# Altium project PHANTOM_VCU.PrjPcb (part 1 of 3)
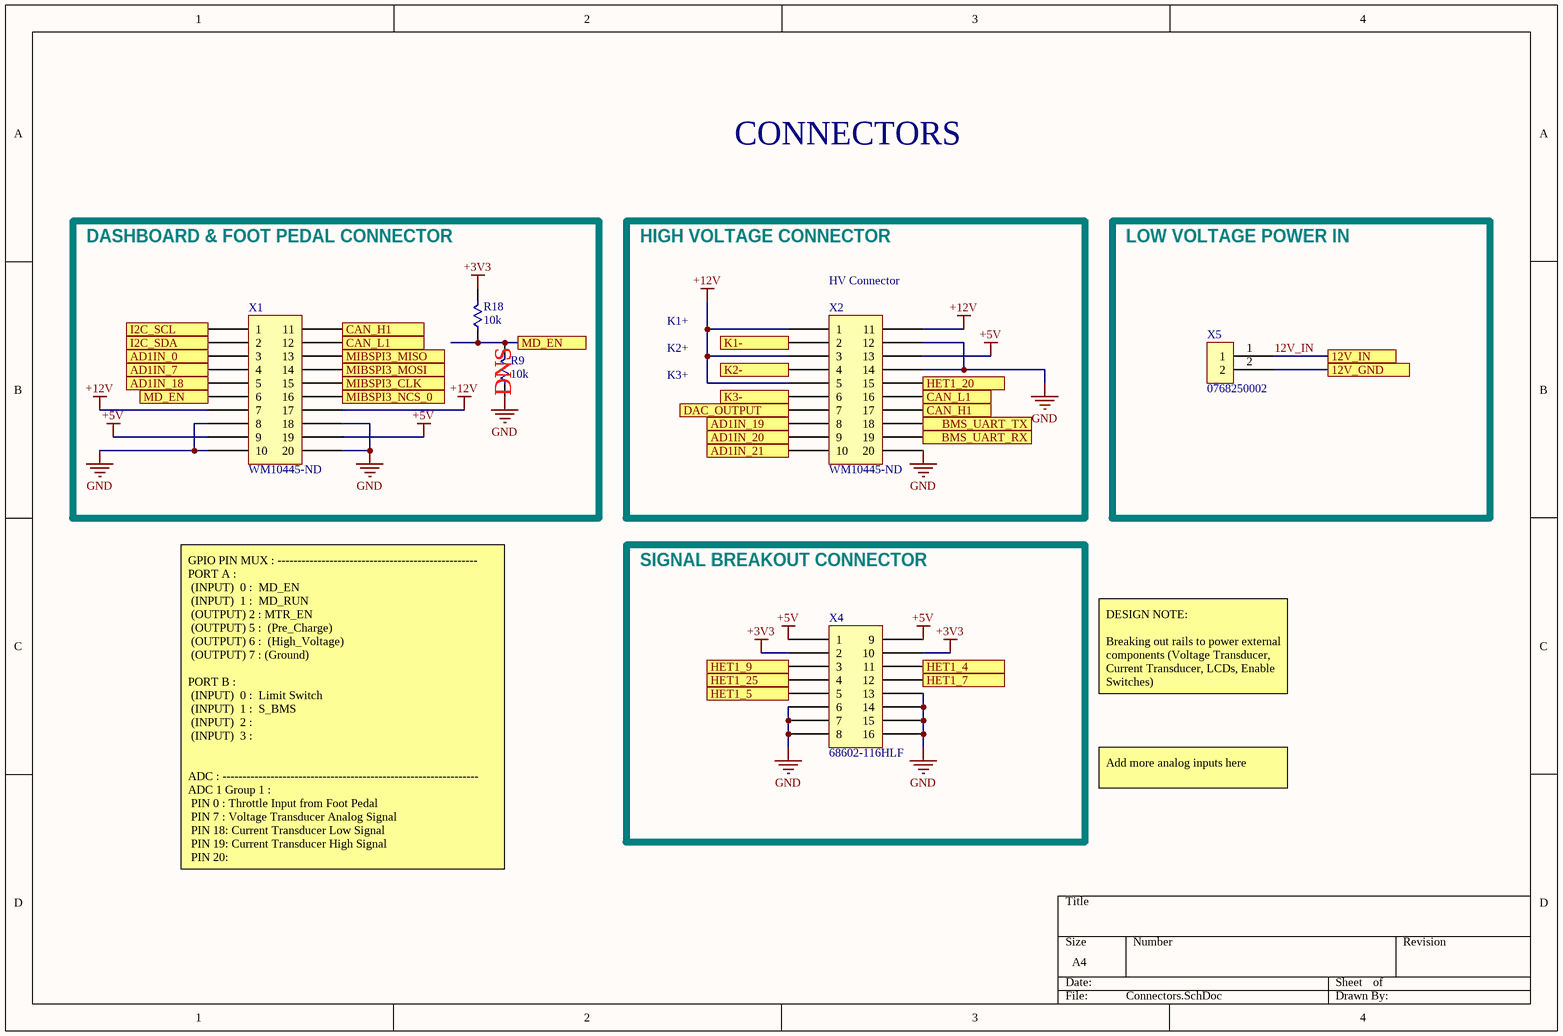
[diagram p0: Connectors.SchDoc]
10 sheets, 183 parts. Net scope: flat (ports and power ports of the same name join across sheets).
Board file: VCU_LAYOUT.PcbDoc
Sheets:
  Connectors.SchDoc
  Power_Sensing.SchDoc
  BUCK_CONVERTERS.SchDoc
  Power_MCU.SchDoc
  VCU_Schematic.SchDoc
  MCU_Signals.SchDoc
  CAN.SchDoc
  Contactor_Switching.SchDoc
  ADC_Decoupling.SchDoc
  DAC.SchDoc

## Sheet Connectors.SchDoc
size A4; DocumentNumber: 1; SheetNumber: 1; SheetTotal: 8

### Parts
R9  10k  [R0402]
R18  10k  [R0402]
X1  WM10445-ND  [MOLEX_20pin]
X2  WM10445-ND  [MOLEX_20pin]
X4  68602-116HLF  [16PIN_HEADER]
X5  0768250002  [MOLEX_2PIN_MEGAFIT]

### Blocks framed on the sheet
DNS: R9 R18 X1
HIGH VOLTAGE CONNECTOR: X2
LOW VOLTAGE POWER IN: X5
SIGNAL BREAKOUT CONNECTOR: X4

### Ports
12V_GND, 12V_IN, AD1IN_0, AD1IN_7, AD1IN_18, AD1IN_19, AD1IN_20, AD1IN_21, BMS_UART_RX, BMS_UART_TX, CAN_H1, CAN_L1, DAC_OUTPUT, HET1_4, HET1_5, HET1_7, HET1_9, HET1_20, HET1_25, I2C_SCL, I2C_SDA, K1-, K2-, K3-, MD_EN, MIBSPI3_CLK, MIBSPI3_MISO, MIBSPI3_MOSI, MIBSPI3_NCS_0

### Nets
+3V3: R18.2 X4.2 X4.10
+5V: X1.9 X1.19 X2.13 X4.1 X4.9
+12V: X1.7 X1.17 X2.1 X2.3 X2.5 X2.11
GND: R9.1 X1.8 X1.10 X1.18 X1.20 X2.12 X2.14 X2.20 X4.6 X4.7 X4.8 X4.13 X4.14 X4.15 X4.16
12V_GND: X5.2 ; port 12V_GND
12V_IN: X5.1 ; port 12V_IN
AD1IN_0: X1.3 ; port AD1IN_0
AD1IN_7: X1.4 ; port AD1IN_7
AD1IN_18: X1.5 ; port AD1IN_18
AD1IN_19: X2.8 ; port AD1IN_19
AD1IN_20: X2.9 ; port AD1IN_20
AD1IN_21: X2.10 ; port AD1IN_21
BMS_UART_RX: X2.19 ; port BMS_UART_RX
BMS_UART_TX: X2.18 ; port BMS_UART_TX
CAN_H1: X1.11 X2.17 ; port CAN_H1
CAN_L1: X1.12 X2.16 ; port CAN_L1
DAC_OUTPUT: X2.7 ; port DAC_OUTPUT
HET1_4: X4.11 ; port HET1_4
HET1_5: X4.5 ; port HET1_5
HET1_7: X4.12 ; port HET1_7
HET1_9: X4.3 ; port HET1_9
HET1_20: X2.15 ; port HET1_20
HET1_25: X4.4 ; port HET1_25
I2C_SCL: X1.1 ; port I2C_SCL
I2C_SDA: X1.2 ; port I2C_SDA
K1-: X2.2 ; port K1-
K2-: X2.4 ; port K2-
K3-: X2.6 ; port K3-
MD_EN: R9.2 R18.1 X1.6 ; port MD_EN
MIBSPI3_CLK: X1.15 ; port MIBSPI3_CLK
MIBSPI3_MISO: X1.13 ; port MIBSPI3_MISO
MIBSPI3_MOSI: X1.14 ; port MIBSPI3_MOSI
MIBSPI3_NCS_0: X1.16 ; port MIBSPI3_NCS_0

### Notes on the sheet
- CONNECTORS
- DASHBOARD & FOOT PEDAL CONNECTOR
- (near X2) HV Connector
- K1+
- K2+
- K3+
- DESIGN NOTE:
  Breaking out rails to power external components (Voltage Transducer, Current Transducer, LCDs, Enable Switches)
- Add more analog inputs here
- GPIO PIN MUX : --------------------------------------------------
  PORT A :
  (INPUT)		0 : 	MD_EN
  (INPUT)		1 : 	MD_RUN
  (OUTPUT)	2 :	MTR_EN
  (OUTPUT)	5 : 	(Pre_Charge)
  (OUTPUT)	6 : 	(High_Voltage)
  (OUTPUT)	7 :	(Ground)
  PORT B :
  (INPUT)		0 : 	Limit Switch
  (INPUT)		1 : 	S_BMS
  (INPUT)		2 :
  (INPUT)		3 :
  ADC : ----------------------------------------------------------------
  ADC 1 Group 1 :
  PIN 0 : Throttle Input from Foot Pedal
  PIN 7 : Voltage Transducer Analog Signal
  PIN 18: Current Transducer Low Signal
  PIN 19: Current Transducer High Signal
  PIN 20:

### Library data of the parts
R9 R18 = RC0402JR-0710KL: RES SMD 10K OHM 5% 1/16W 0402; Manufacturer: Yageo; Resistance: 10kR; Power Rating: 62.5mW; Voltage Rating: 50V; Temperature Coefficient: 100ppm/°C; Max Power Dissipation: 63mW; Supplier 1: Digi-Key; Manufacturer Part Number: RC0402JR-0710KL; Stock 1: 47303622; Pricing 1: 1=0.1, 10=0.018, 100=0.0073, 1000=0.0033, 2500=0.0029, 5000=0.0024 (USD); Case/Package: 0402; Case Code (Metric): 1005; Case Code (Imperial): 0402; Min Operating Temperature: -55°C; Max Operating Temperature: 155°C; Packaging: Tape and Reel; Tolerance: 5%; Package Quantity: 1; Composition: Thick Film; Number of Terminations: 2; Termination: SMD/SMT; Military Standard: Not; Features: Moisture Resistant; Length: 1mm; Height: 0.016inch; Width: 0.02inch; Depth: 0.5mm; REACH SVHC: Unknown; Lead Free: Lead Free; Supplier Part Number 1: 311-10KJRCT-ND
X1 X2 = 0346916200: CONN_20Positions Molex Stac64 Header, Shrouded Connector 0.100" (2.54mm) Through Hole, Right Angle Tin; Number of Positions: 20; Connector Type: Male Pin; Pitch: 0.1inch; Supplier 1: Digi-Key; Manufacturer: Molex; Manufacturer Part Number: 0346916200; Stock 1: 334; Pricing 1: 1=3.07, 10=2.946, 100=2.4546, 500=2.0864, 1000=1.7796, 5000=1.5955 (USD); Case/Package: 100; Colour: Black; Contact Plating: Tin; Package Quantity: 560; Packaging: Tray; Number of Rows: 2; Termination: Solder; Row Spacing: 0.1inch; ComponentLink1URL: https://datasheet.ciiva.com/29142/987651-0141-29142848.pdf; ComponentLink1Description: https://datasheet.ciiva.com/29142/987651-0141-29142848.pdf; Supplier Part Number 1: WM10445-ND
X4 = 68602-116HLF: CONN_HeaderPins16pos1  6 Positions Header, Unshrouded Connector 0.100" (2.54mm) Through Hole Gold or Gold, GXT™; Manufacturer: Amphenol FCI; Current Rating: 3A; Voltage Rating: 1.5kV; Number of Positions: 16; Gender: Male; Connector Type: Male Pin; Insulation Resistance: 5GR; Row Spacing: 0.1inch; Mating Post Length: 5.84mm; Supplier 1: Digi-Key; Manufacturer Part Number: 68602-116HLF; Stock 1: 1898; Pricing 1: 1=0.79, 10=0.698, 100=0.6019, 500=0.4925, 1000=0.4378, 5000=0.383, 10000=0.3639 (USD); Mount: Through Hole; Contact Plating: Nickel,Gold,GXT; Contact Material: Bronze; Colour: Black; Housing Colour: Black; Housing Material: Thermoplastic; Min Operating Temperature: -65°C; Max Operating Temperature: 125°C; Number of Rows: 2; Packaging: Bulk; Package Quantity: 100; Termination: Solder; Max Voltage Rating (AC): 1.5kV; Number of Contacts: 16; Orientation: Straight; Contact Gender: Male; Length: 20.32mm; Pitch: 2.54mm; Depth: 4.83mm; Contact Mating Length: 0.23inch; Termination Post Length: 3.81mm; Radiation Hardening: No; REACH SVHC: No SVHC; Flammability Rating: UL94 V-0; ComponentLink1URL: https://datasheet.ciiva.com/16726/67996-16726040.pdf; ComponentLink1Description: https://datasheet.ciiva.com/16726/67996-16726040.pdf; ComponentLink2URL: https://datasheet.ciiva.com/9465/67996-9465931.pdf; ComponentLink2Description: https://datasheet.ciiva.com/9465/67996-9465931.pdf; ComponentLink3URL: https://datasheet.ciiva.com/728/67996-728940.pdf; ComponentLink3Description: https://datasheet.ciiva.com/728/67996-728940.pdf; ComponentLink4URL: https://datasheet.ciiva.com/5157/67996-225486-5157197.pdf; ComponentLink4Description: https://datasheet.ciiva.com/5157/67996-225486-5157197.pdf; Supplier Part Number 1: 609-3364-ND
X5 = 0768250002: CONN_2Position_MEGAFIT Molex Through Hole, Right Angle Tin; Number of Positions: 2; Connector Type: Male Pin; Row Spacing: 0.224inch; Supplier 1: Digi-Key; Manufacturer: Molex; Manufacturer Part Number: 0768250002; Stock 1: 2862; Pricing 1: 1=1.08, 10=0.946, 25=0.89, 50=0.853, 100=0.816, 250=0.7418, 500=0.6676, 1000=0.5934, 2500=0.5378 (USD); Mount: Through Hole; Colour: Black; Contact Plating: Tin; Packaging: Tray; Number of Rows: 2; Termination: Solder; Fastening Type: Ramp; ComponentLink1URL: http://www.molex.com/pdm_docs/ps/PS-76823-100.pdf; ComponentLink1Description: http://www.molex.com/pdm_docs/ps/PS-76823-100.pdf; Supplier Part Number 1: WM11969-ND

## Sheet Power_Sensing.SchDoc
size A4; DocumentNumber: 2; SheetNumber: 2; SheetTotal: 8
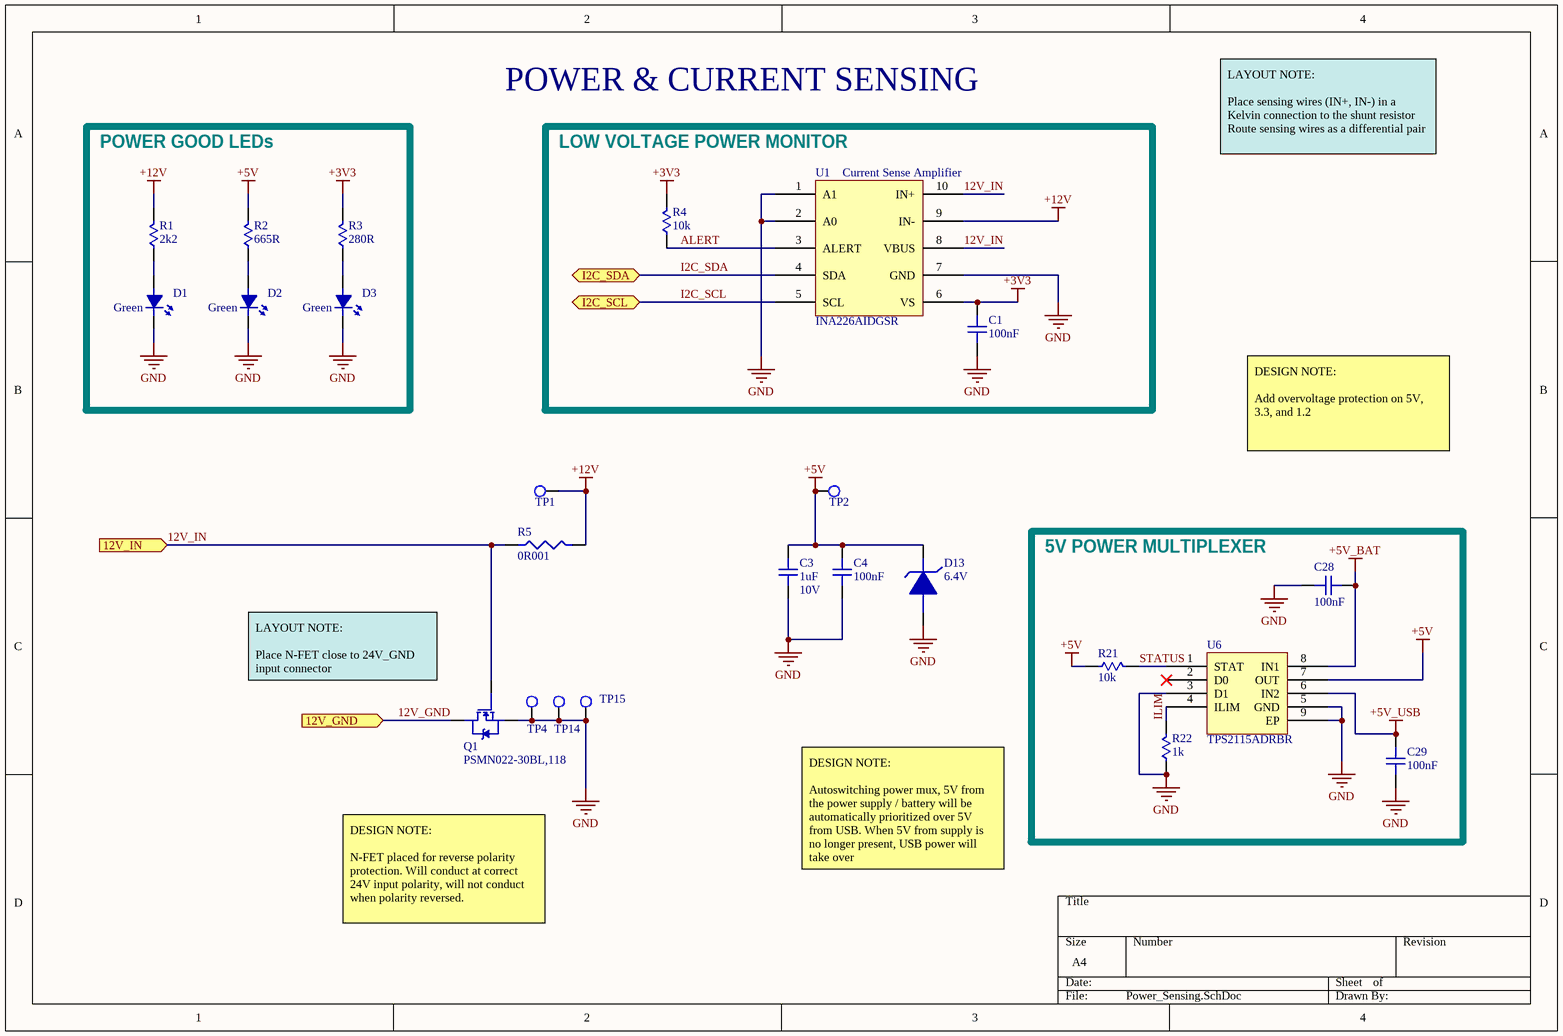
[diagram p1: Power_Sensing.SchDoc]

### Parts
C1  100nF  [C0402]
C3  1uF  Voltage Rating: 10V  [C0402]
C4  100nF  [C0402]
C28  100nF  [C0402]
C29  100nF  [C0402]
D1  Green  [LED_0603]
D2  Green  [LED_0603]
D3  Green  [LED_0603]
D13  6.4V  [DIODE_TVS]
Q1  PSMN022-30BL,118  [D2PAK_FETs]
R1  2k2  [R0402]
R2  665R  [R0402]
R3  280R  [R0402]
R4  10k  [R0402]
R5  0R001  [R2512]
R21  10k  [R0402]
R22  1k  [R0402]
TP1  5015  [TP_HOOK]  (value not drawn)
TP2  5015  [TP_HOOK]  (value not drawn)
TP4  5015  [TP_HOOK]  (value not drawn)
TP14  5015  [TP_HOOK]  (value not drawn)
TP15  5015  [TP_HOOK]  (value not drawn)
U1  INA226AIDGSR  [10-VSSOP_INA226]
U6  TPS2115ADRBR  [VSON-8]

### Blocks framed on the sheet
POWER GOOD LEDs: D1-D3 R1-R3
LOW VOLTAGE POWER MONITOR: C1 R4 U1
5V POWER MULTIPLEXER: C28 C29 R21 R22 U6

### Ports
12V_GND, 12V_IN, I2C_SCL, I2C_SDA

### Nets
+3V3: C1.2 R3.2 R4.2 U1.6(VS)
+5V: C3.2 C4.2 D13.1 R2.2 R21.1 TP2.1 U6.7(OUT)
+5V_BAT: C28.1 U6.8(IN1)
+5V_USB: C29.2 U6.6(IN2)
+12V: R1.2 R5.2 TP1.1 U1.9(IN-)
GND: C1.1 C3.1 C4.1 C28.2 C29.1 D1.2 D2.2 D3.2 D13.2 Q1.3 R22.1 TP4.1 TP14.1 TP15.1 U1.1(A1) U1.2(A0) U1.7(GND) U6.3(D1) U6.5(GND) U6.9(EP)
12V_GND: Q1.4 ; port 12V_GND
12V_IN: Q1.1 R5.1 U1.8(VBUS) U1.10(IN+) ; port 12V_IN
ALERT: R4.1 U1.3(ALERT)
I2C_SCL: U1.5(SCL) ; port I2C_SCL
I2C_SDA: U1.4(SDA) ; port I2C_SDA
ILIM: R22.2 U6.4(ILIM)
STATUS: R21.2 U6.1(STAT)
NetD1_1: D1.1 R1.1
NetD2_1: D2.1 R2.1
NetD3_1: D3.1 R3.1

Not connected (* = marked no-connect by the designer): U6 2(D0)*

### Notes on the sheet
- POWER & CURRENT SENSING
- (near U1) Current Sense Amplifier
- LAYOUT NOTE:
  Place sensing wires (IN+, IN-) in a Kelvin connection to the shunt resistor
  Route sensing wires as a differential pair
- DESIGN NOTE:
  Add overvoltage protection on 5V, 3.3, and 1.2
- (near Q1) LAYOUT NOTE:
  Place N-FET close to 24V_GND input connector
- DESIGN NOTE:
  N-FET placed for reverse polarity protection. Will conduct at correct 24V input polarity, will not conduct when polarity reversed.
- DESIGN NOTE:
  Autoswitching power mux, 5V from the power supply / battery will be automatically prioritized over 5V from USB. When 5V from supply is no longer present, USB power will take over

### Library data of the parts
C1 C4 C28 C29 = CL05A104MP5NNNC: CAP MLCC 0.1uF 10V X5R 0402 20% SMD 0402 85C Paper T/R; Manufacturer: Samsung; Supplier 1: Digi-Key; Manufacturer Part Number: CL05A104MP5NNNC; Stock 1: 100000; Pricing 1: 1=0.1, 10=0.024, 100=0.0106, 500=0.0076, 1000=0.006, 2500=0.0054, 5000=0.005 (USD); Mount: Surface Mount; Case/Package: 0402; Case Code (Metric): 1005; Case Code (Imperial): 0402; Min Operating Temperature: -55°C; Max Operating Temperature: 85°C; Packaging: Tape and Reel; Capacitance: 100nF; Tolerance: 20%; Voltage Rating: 10V; Dielectric: X5R; Voltage Rating (DC): 10V; Length: 1mm; Height: 0.5mm; Width: 0.02inch; Thickness: 0.022inch; Depth: 0.5mm; Radiation Hardening: No; Lead Free: Lead Free; ComponentLink1URL: https://media.digikey.com/pdf/Data%20Sheets/Samsung%20PDFs/CL_Series_MLCC_ds.pdf; ComponentLink1Description: https://media.digikey.com/pdf/Data%20Sheets/Samsung%20PDFs/CL_Series_MLCC_ds.pdf; Supplier Part Number 1: 1276-1443-1-ND
C3 = CL05A105MP5NNNC: CAP MLCC 1uF 10V 0402 X5R 20% SMD 0402 85C Paper T/R; Manufacturer: Samsung; Supplier 1: Digi-Key; Manufacturer Part Number: CL05A105MP5NNNC; Stock 1: 100000; Pricing 1: 1=0.1, 10=0.031, 100=0.014, 500=0.01, 1000=0.0079, 2500=0.0072, 5000=0.0066 (USD); Mount: Surface Mount; Case/Package: 0402; Case Code (Metric): 1005; Case Code (Imperial): 0402; Min Operating Temperature: -55°C; Max Operating Temperature: 85°C; Package Quantity: 1; Packaging: Tape and Reel; Capacitance: 1uF; Tolerance: 20%; Dielectric: X5R; Voltage Rating (DC): 10V; Length: 1mm; Height: 0.5mm; Width: 0.02inch; Thickness: 0.022inch; Depth: 0.5mm; Radiation Hardening: No; Lead Free: Lead Free; ComponentLink1URL: https://media.digikey.com/pdf/Data%20Sheets/Samsung%20PDFs/CL_Series_MLCC_ds.pdf; ComponentLink1Description: https://media.digikey.com/pdf/Data%20Sheets/Samsung%20PDFs/CL_Series_MLCC_ds.pdf; Supplier Part Number 1: 1276-1448-1-ND
D1-D3 = 150060VS75000: LED GREEN CLEAR 0603 SMD  LED, 0603, B GREEN,  40MCD, 570NM; Manufacturer: Wurth Electronics; Viewing Angle: 140°; Forward Voltage: 2V; Lens Style: Clear,Rectangular; Forward Current: 30mA; Test Current: 20mA; Supplier 1: Digi-Key; Manufacturer Part Number: 150060VS75000; Stock 1: 207370; Pricing 1: 1=0.14, 50=0.129, 100=0.11, 500=0.095 (USD); Mount: Surface Mount; Case/Package: 0603; Number of Pins: 2; Color: Green; Case Code (Metric): 1608; Case Code (Imperial): 0603; Min Operating Temperature: -40°C; Max Operating Temperature: 85°C; Luminous Intensity: 40mcd; Wavelength: 570nm; Package Quantity: 1; Packaging: Tape and Reel; Dominant Wavelength: 570nm; Length: 1.6mm; Height: 0.7mm; Width: 0.8mm; REACH SVHC: Unknown; ComponentLink1URL: http://www.farnell.com/datasheets/1911347.pdf; ComponentLink1Description: http://www.farnell.com/datasheets/1911347.pdf; ComponentLink2URL: https://katalog.we-online.de/led/datasheet/150060VS75000.pdf; ComponentLink2Description: https://katalog.we-online.de/led/datasheet/150060VS75000.pdf; ComponentLink3URL: https://www.distrelec.biz/Web/Downloads/_t/ds/150060VS75000_eng_tds.pdf?mime=application%2Fpdf; ComponentLink3Description: https://www.distrelec.biz/Web/Downloads/_t/ds/150060VS75000_eng_tds.pdf?mime=application%2Fpdf; ComponentLink4URL: http://www.produktinfo.conrad.com/datenblaetter/750000-774999/759431-da-01-en-CHIPLED_0603_W_KL_H_GRUEN_150060VS7500.pdf; ComponentLink4Description: http://www.produktinfo.conrad.com/datenblaetter/750000-774999/759431-da-01-en-CHIPLED_0603_W_KL_H_GRUEN_150060VS7500.pdf; Supplier Part Number 1: 732-4980-1-ND
D13 = SMAJ5.0A: DIODE TVS_6V4 5VWM 9.2VC SMA; Manufacturer: Littelfuse; Clamping Voltage: 9.2V; Polarity: Unidirectional; Power Dissipation: 400W; Voltage Rating (DC): 5V; Number of Elements: 1; Max Surge Current: 43.5A; Power Line Protection: No; Test Current: 10mA; Max Breakdown Voltage: 7V; Max Reverse Leakage Current: 800uA; Max Power Dissipation: 3.3W; Element Configuration: Single; Supplier 1: Digi-Key; Manufacturer Part Number: SMAJ5.0A; Stock 1: 78251; Pricing 1: 1=0.51, 10=0.359, 25=0.2948, 100=0.2359, 250=0.1716, 500=0.1394, 1000=0.1072, 2500=0.0965 (USD); Mount: Surface Mount; Number of Pins: 2; Min Operating Temperature: -65°C; Max Operating Temperature: 150°C; Direction: Unidirectional; Package Quantity: 5000; Operating Supply Voltage: 5V; Packaging: Tape and Reel; Reverse Breakdown Voltage: 6.4V; Number of Unidirectional Channels: 1; Reverse Standoff Voltage: 5V; Min Breakdown Voltage: 6.4V; Peak Pulse Power: 400W; Breakdown Voltage: 6.4V; Number of Channels: 1; Termination: SMD/SMT; Peak Pulse Current: 43.5A; Leakage Current: 800uA; Length: 4.5mm; Height: 2.087mm; Width: 2.79mm; Radiation Hardening: No; REACH SVHC: No SVHC; Lead Free: Lead Free; ComponentLink1URL: https://datasheet.ciiva.com/330/littelfuse-tvs-diode-smaj-datasheet-pdf-330724.pdf; ComponentLink1Description: https://datasheet.ciiva.com/330/littelfuse-tvs-diode-smaj-datasheet-pdf-330724.pdf; ComponentLink2URL: https://datasheet.ciiva.com/330/littelfuse-tvs-diode-smaj-datasheet-pdf-330725.pdf; ComponentLink2Description: https://datasheet.ciiva.com/330/littelfuse-tvs-diode-smaj-datasheet-pdf-330725.pdf; ComponentLink3URL: https://datasheet.ciiva.com/330/littelfuse-tvs-diode-smaj-datasheet-pdf-330726.pdf; ComponentLink3Description: https://datasheet.ciiva.com/330/littelfuse-tvs-diode-smaj-datasheet-pdf-330726.pdf; ComponentLink4URL: https://datasheet.ciiva.com/16380/littelfuse-tvs-diode-smaj-16380982.pdf; ComponentLink4Description: https://datasheet.ciiva.com/16380/littelfuse-tvs-diode-smaj-16380982.pdf; ComponentLink5URL: https://datasheet.ciiva.com/25624/0900766b810f4edb-25624839.pdf; ComponentLink5Description: https://datasheet.ciiva.com/25624/0900766b810f4edb-25624839.pdf; ComponentLink6URL: https://datasheet.ciiva.com/28473/607617-28473433.pdf; ComponentLink6Description: https://datasheet.ciiva.com/28473/607617-28473433.pdf; ComponentLink7URL: https://datasheet.ciiva.com/4507/littelfuse-tvs-diode-smaj-23503-4507964.pdf; ComponentLink7Description: https://datasheet.ciiva.com/4507/littelfuse-tvs-diode-smaj-23503-4507964.pdf; ComponentLink8URL: https://datasheet.ciiva.com/8062/littelfuse-tvs-diode-smaj-8062271.pdf; ComponentLink8Description: https://datasheet.ciiva.com/8062/littelfuse-tvs-diode-smaj-8062271.pdf; Supplier Part Number 1: SMAJ5.0ALFCT-ND
Q1 = PSMN022-30BL,118: MOSFET N-CH 30V 30A 22.6mOhm Rds(ON); Manufacturer: NXP Semiconductors; Rds On Max: 22.6mR; Input Capacitance: 447pF; Rise Time: 29ns; Max Power Dissipation: 41W; Gate to Source Voltage (Vgs): 20V; Turn-On Delay Time: 12ns; Turn-Off Delay Time: 17ns; Fall Time: 7ns; Number of Elements: 1; Element Configuration: Single; Supplier 1: Digi-Key; Manufacturer Part Number: PSMN022-30BL,118; Stock 1: 8400; Pricing 1: 1=0.99, 10=0.867, 100=0.6687 (USD); Case/Package: SOT; Number of Pins: 3; Contact Plating: Tin; Min Operating Temperature: -55°C; Max Operating Temperature: 175°C; Package Quantity: 1; Packaging: Tape and Reel; Max Dual Supply Voltage: 30V; Drain to Source Voltage (Vdss): 30V; Continuous Drain Current (ID): 30A; Drain to Source Breakdown Voltage: 30V; Drain to Source Resistance: 22.6mR; Power Dissipation: 41W; Radiation Hardening: No; Lead Free: Lead Free; ComponentLink1URL: http://www.nxp.com/documents/data_sheet/PSMN022-30BL.pdf; ComponentLink1Description: http://www.nxp.com/documents/data_sheet/PSMN022-30BL.pdf; Supplier Part Number 1: 1727-7117-1-ND
R1 = RC0402JR-072K2L: RES SMD 2.2K OHM 5% 1/16W 0402; Manufacturer: Yageo; Resistance: 2.2kR; Power Rating: 63mW; Voltage Rating: 50V; Temperature Coefficient: 100ppm/°C; Supplier 1: Digi-Key; Manufacturer Part Number: RC0402JR-072K2L; Stock 1: 7890813; Pricing 1: 1=0.1, 10=0.018, 100=0.0073, 1000=0.0033, 2500=0.0029, 5000=0.0024 (USD); Case/Package: 0402; Weight: 2.3E-05oz; Case Code (Metric): 1005; Case Code (Imperial): 0402; Min Operating Temperature: -55°C; Max Operating Temperature: 155°C; Tolerance: 5%; Packaging: Tape and Reel; Composition: Thick Film; Termination: SMD/SMT; Military Standard: Not; Package Quantity: 1; Number of Terminations: 2; Max Power Dissipation: 63mW; Working Voltage: 50V; Features: Moisture Resistant; Length: 1mm; Height: 0.016inch; Depth: 0.5mm; Width: 0.02inch; REACH SVHC: Unknown; Lead Free: Lead Free; Supplier Part Number 1: 311-2.2KJRCT-ND
R2 = RC0402FR-07665RL: RES SMD 665 OHM 1% 0402 1/16W; Manufacturer: Yageo; Power Rating: 62.5mW; Voltage Rating: 50V; Max Power Dissipation: 63mW; Temperature Coefficient: 100ppm/°C; Supplier 1: Digi-Key; Manufacturer Part Number: RC0402FR-07665RL; Stock 1: 268997; Pricing 1: 1=0.1, 10=0.016, 100=0.0067, 1000=0.003, 2500=0.0026, 5000=0.0022 (USD); Case/Package: 0402; Case Code (Imperial): 0402; Case Code (Metric): 1005; Contact Plating: Matte,Tin; Min Operating Temperature: -55°C; Max Operating Temperature: 155°C; Packaging: Tape and Reel; Resistance: 665R; Tolerance: 1%; Composition: Thick Film; Number of Terminations: 2; Termination: SMD/SMT; Military Standard: Not; Features: Moisture Resistant; Length: 1mm; Height: 0.016inch; Width: 0.02inch; Depth: 0.5mm; Lead Free: Lead Free; ComponentLink1URL: http://www.yageo.com/documents/recent/PYu-RC0402_51_RoHS_L_6.pdf; ComponentLink1Description: http://www.yageo.com/documents/recent/PYu-RC0402_51_RoHS_L_6.pdf; Supplier Part Number 1: YAG3208CT-ND
R3 = RC0402FR-07280RL: RES SMD 280 OHM 1% 1/16W 0402; Manufacturer: Yageo; Power Rating: 62.5mW; Voltage Rating: 50V; Temperature Coefficient: 100ppm/°C; Max Power Dissipation: 63mW; Supplier 1: Digi-Key; Manufacturer Part Number: RC0402FR-07280RL; Stock 1: 282493; Pricing 1: 1=0.1, 10=0.016, 100=0.0067, 1000=0.003, 2500=0.0026, 5000=0.0022 (USD); Case/Package: 0402; Weight: 2.3E-05oz; Case Code (Imperial): 0402; Case Code (Metric): 1005; Min Operating Temperature: -55°C; Max Operating Temperature: 155°C; Resistance: 280R; Tolerance: 1%; Packaging: Tape and Reel; Package Quantity: 1; Termination: SMD/SMT; Composition: Thick Film; Number of Terminations: 2; Military Standard: Not; Voltage Rating (DC): 50V; Features: Moisture Resistant; Length: 1mm; Height: 0.016inch; Width: 0.5mm; Depth: 0.5mm; Lead Free: Lead Free; ComponentLink1URL: http://www.yageo.com.tw/exep/pages/download/literatures/PYu-R_INT-thick_7.pdf; ComponentLink1Description: http://www.yageo.com.tw/exep/pages/download/literatures/PYu-R_INT-thick_7.pdf; ComponentLink2URL: http://www.yageo.com/documents/recent/PYu-RC_Group_51_RoHS_L_9.pdf; ComponentLink2Description: http://www.yageo.com/documents/recent/PYu-RC_Group_51_RoHS_L_9.pdf; ComponentLink3URL: http://www.yageo.com/documents/recent/PYu-RC0402_51_RoHS_L_6_r.pdf; ComponentLink3Description: http://www.yageo.com/documents/recent/PYu-RC0402_51_RoHS_L_6_r.pdf; Supplier Part Number 1: 311-280LRCT-ND
R4 R21 = RC0402JR-0710KL: as R9 on sheet Connectors; Supplier 1: Digi-Key; Manufacturer Part Number: RC0402JR-0710KL; Stock 1: 47303622; Pricing 1: 1=0.1, 10=0.018, 100=0.0073, 1000=0.0033, 2500=0.0029, 5000=0.0024 (USD); Case/Package: 0402; Case Code (Metric): 1005; Case Code (Imperial): 0402; Min Operating Temperature: -55°C; Max Operating Temperature: 155°C; Packaging: Tape and Reel; Tolerance: 5%; Package Quantity: 1; Composition: Thick Film; Number of Terminations: 2; Termination: SMD/SMT; Military Standard: Not; Features: Moisture Resistant; Length: 1mm; Height: 0.016inch; Width: 0.02inch; Depth: 0.5mm; REACH SVHC: Unknown; Lead Free: Lead Free; Supplier Part Number 1: 311-10KJRCT-ND
R5 = ERJ-M1WTF1M0U: Res Thick Film 2512 0.001 Ohm 1% 1W 250ppm/C to 450ppm/C Molded SMD Embossed Carrier T/R; Manufacturer: Panasonic ECG; Resistance: 1mR; Temperature Coefficient: 450ppm/°C; Supplier 1: Digi-Key; Manufacturer Part Number: ERJ-M1WTF1M0U; Stock 1: 36740; Pricing 1: 1=0.55, 10=0.456, 25=0.3908, 50=0.3516, 100=0.3061, 250=0.2735, 500=0.2214, 1000=0.1791 (USD); Mount: Surface Mount; Case/Package: 2512; Number of Pins: 2; Case Code (Metric): 6432; Case Code (Imperial): 2512; Contact Plating: Tin; Min Operating Temperature: -55°C; Max Operating Temperature: 170°C; Package Quantity: 1; Packaging: Tape and Reel; Power Rating: 1W; Tolerance: 1%; Composition: Thick Film,Metal Strip,Metal Element; Number of Terminations: 2; Termination: SMD/SMT; Military Standard: Not; Max Power Dissipation: 1W; Length: 6.4mm; Height: 0.8mm; Width: 0.126inch; Depth: 3.2mm; Radiation Hardening: No; REACH SVHC: No SVHC; Lead Free: Lead Free; ComponentLink1URL: https://datasheet.ciiva.com/11811/0900766b80befc3b-11811491.pdf; ComponentLink1Description: https://datasheet.ciiva.com/11811/0900766b80befc3b-11811491.pdf; ComponentLink2URL: https://datasheet.ciiva.com/9198/aoa0000ce7-9198885.pdf; ComponentLink2Description: https://datasheet.ciiva.com/9198/aoa0000ce7-9198885.pdf; ComponentLink3URL: https://datasheet.ciiva.com/7777/39800-7777943.pdf; ComponentLink3Description: https://datasheet.ciiva.com/7777/39800-7777943.pdf; ComponentLink4URL: https://datasheet.ciiva.com/16216/aoa0000ce7-16216983.pdf; ComponentLink4Description: https://datasheet.ciiva.com/16216/aoa0000ce7-16216983.pdf; ComponentLink5URL: https://datasheet.ciiva.com/24072/aoa0000ce7-60136-24072248.pdf; ComponentLink5Description: https://datasheet.ciiva.com/24072/aoa0000ce7-60136-24072248.pdf; ComponentLink6URL: https://datasheet.ciiva.com/16512/aoa0000ce7-16512553.pdf; ComponentLink6Description: https://datasheet.ciiva.com/16512/aoa0000ce7-16512553.pdf; ComponentLink7URL: https://datasheet.ciiva.com/16788/70260812-16788394.pdf; ComponentLink7Description: https://datasheet.ciiva.com/16788/70260812-16788394.pdf; ComponentLink8URL: https://datasheet.ciiva.com/5996/39800-5996507.pdf; ComponentLink8Description: https://datasheet.ciiva.com/5996/39800-5996507.pdf; ComponentLink9URL: https://datasheet.ciiva.com/17215/aoa0000ce7-17215229.pdf; ComponentLink9Description: https://datasheet.ciiva.com/17215/aoa0000ce7-17215229.pdf; ComponentLink10URL: https://datasheet.ciiva.com/30206/aoa0000ce7-30206797.pdf; ComponentLink10Description: https://datasheet.ciiva.com/30206/aoa0000ce7-30206797.pdf; ComponentLink11URL: https://datasheet.ciiva.com/16785/70260812-16785566.pdf; ComponentLink11Description: https://datasheet.ciiva.com/16785/70260812-16785566.pdf; Supplier Part Number 1: P1.0NDCT-ND
R22 = RR0510P-102-D: RES SMD 1K OHM 0.5% 1/16W 0402; Manufacturer: Susumu; Resistance: 1kR; Power Rating: 63mW; Voltage Rating: 25V; Temperature Coefficient: 25ppm/°C; Supplier 1: Digi-Key; Manufacturer Part Number: RR0510P-102-D; Stock 1: 721157; Pricing 1: 1=0.1, 10=0.074, 100=0.0285, 1000=0.0125, 2500=0.0108, 5000=0.0097 (USD); Case/Package: 0402; Number of Pins: 2; Case Code (Metric): 1005; Case Code (Imperial): 0402; Min Operating Temperature: -55°C; Max Operating Temperature: 125°C; Package Quantity: 1; Tolerance: 0.5%; Packaging: Tape and Reel; Composition: Thin Film; Number of Terminations: 2; Termination: SMD/SMT; Max Power Dissipation: 63mW; Voltage Rating (DC): 25V; Length: 0.039inch; Height: 0.016inch; Width: 0.02inch; REACH SVHC: Unknown; Lead Free: Lead Free; ComponentLink1URL: http://www.susumu.co.jp/common/pdf/n_catalog_partition05_en.pdf; ComponentLink1Description: http://www.susumu.co.jp/common/pdf/n_catalog_partition05_en.pdf; ComponentLink2URL: http://www.farnell.com/datasheets/1581132.pdf; ComponentLink2Description: http://www.farnell.com/datasheets/1581132.pdf; Supplier Part Number 1: RR05P1.0KDCT-ND
TP1 TP2 TP4 TP14 TP15 = 5015: TEST POINT, PCB, SMT; Manufacturer: Keystone Electronics; Number of Ports: 1; Supplier 1: Digi-Key; Manufacturer Part Number: 5015; Stock 1: 1937775; Pricing 1: 1=0.44, 10=0.421, 25=0.3604, 50=0.3064, 100=0.2944, 250=0.2644, 500=0.2524 (USD); Mount: Surface Mount; Colour: White; Contact Material: Bronze; Contact Plating: Tin,Silver,Lead; Material: Bronze,Silver; Package Quantity: 1; Packaging: Tape and Reel; Termination: Solder; Orientation: Straight; Length: 2.66mm; Height: 0.06inch; Thickness: 0.01inch; Depth: 1.01mm; REACH SVHC: No SVHC; Lead Free: Lead Free; ComponentLink1URL: https://datasheet.ciiva.com/2917/5015-2917616.pdf; ComponentLink1Description: https://datasheet.ciiva.com/2917/5015-2917616.pdf; ComponentLink2URL: https://datasheet.ciiva.com/2917/5015-2917617.pdf; ComponentLink2Description: https://datasheet.ciiva.com/2917/5015-2917617.pdf; ComponentLink3URL: https://datasheet.ciiva.com/1123/5015-1123862.pdf; ComponentLink3Description: https://datasheet.ciiva.com/1123/5015-1123862.pdf; ComponentLink4URL: https://datasheet.ciiva.com/16883/70182998-16883734.pdf; ComponentLink4Description: https://datasheet.ciiva.com/16883/70182998-16883734.pdf; Supplier Part Number 1: 36-5015CT-ND
U1 = INA226AIDGSR: IC MONITOR PWR/CURR BIDIR 10MSOP; Manufacturer: Texas Instruments; Min Supply Voltage: 2.7V; Max Supply Voltage: 5.5V; Nominal Supply Current: 330uA; Common Mode Rejection Ratio: 140dB; Output Current: 10mA; Input Bias Current: 10uA; Input Offset Voltage (Vos): 2.5uV; Accuracy: 0.02%; Supplier 1: Digi-Key; Manufacturer Part Number: INA226AIDGSR; Stock 1: 62674; Pricing 1: 1=2.95, 10=2.648, 100=2.1692, 500=1.8466, 1000=1.5574 (USD); Mount: Surface Mount; Case/Package: VSSOP; Number of Pins: 10; Contact Plating: Gold; Min Operating Temperature: -40°C; Max Operating Temperature: 125°C; Packaging: Tape and Reel; Package Quantity: 1; Radiation Hardening: No; REACH SVHC: No SVHC; Lead Free: Lead Free; ComponentLink1URL: https://datasheet.ciiva.com/1939/ina226-1939633.pdf; ComponentLink1Description: https://datasheet.ciiva.com/1939/ina226-1939633.pdf; ComponentLink2URL: https://datasheet.ciiva.com/1939/ina226-1939634.pdf; ComponentLink2Description: https://datasheet.ciiva.com/1939/ina226-1939634.pdf; ComponentLink3URL: https://datasheet.ciiva.com/1939/ina226-1939635.pdf; ComponentLink3Description: https://datasheet.ciiva.com/1939/ina226-1939635.pdf; ComponentLink4URL: https://datasheet.ciiva.com/14196/ina226-14196741.pdf; ComponentLink4Description: https://datasheet.ciiva.com/14196/ina226-14196741.pdf; ComponentLink5URL: https://datasheet.ciiva.com/4875/sbos547-126280-4875559.pdf; ComponentLink5Description: https://datasheet.ciiva.com/4875/sbos547-126280-4875559.pdf; ComponentLink6URL: https://datasheet.ciiva.com/22693/1840205-22693516.pdf; ComponentLink6Description: https://datasheet.ciiva.com/22693/1840205-22693516.pdf; Supplier Part Number 1: 296-29034-1-ND
U6 = TPS2115ADRBR: IC OR CTRLR SRC SELECT 8SON; Manufacturer: Texas Instruments; Operating Supply Voltage: 5.5V; Number of Inputs: 2; Number of Outputs: 1; Output Current: 1.25A; Max Power Dissipation: 2.5W; Min Input Voltage: 2.8V; On-State Resistance: 150mR; Turn-On Delay Time: 1ms; Turn-Off Delay Time: 5ms; Max Supply Current: 55uA; Supplier 1: Digi-Key; Manufacturer Part Number: TPS2115ADRBR; Stock 1: 13497; Pricing 1: 1=2.01, 10=1.801, 100=1.448, 500=1.1897, 1000=0.9857 (USD); Case/Package: TSSOP; Number of Pins: 8; Weight: 0.000847oz; Min Operating Temperature: -40°C; Max Operating Temperature: 85°C; Package Quantity: 3000; Packaging: Tape and Reel; Max Output Current: 1.25A; Max Input Voltage: 5.5V; Operating Supply Current: 55uA; Current - Output 2: 1.25A; Radiation Hardening: No; Lead Free: Lead Free; REACH SVHC: No SVHC; ComponentLink1URL: https://datasheet.ciiva.com/15109/getdatasheetpartid-221489-15109265.pdf; ComponentLink1Description: https://datasheet.ciiva.com/15109/getdatasheetpartid-221489-15109265.pdf; ComponentLink2URL: https://datasheet.ciiva.com/1960/tps2115a-1960792.pdf; ComponentLink2Description: https://datasheet.ciiva.com/1960/tps2115a-1960792.pdf; ComponentLink3URL: https://datasheet.ciiva.com/3232/tps2115a-3232536.pdf; ComponentLink3Description: https://datasheet.ciiva.com/3232/tps2115a-3232536.pdf; ComponentLink4URL: https://datasheet.ciiva.com/1960/tps2115a-1960793.pdf; ComponentLink4Description: https://datasheet.ciiva.com/1960/tps2115a-1960793.pdf; ComponentLink5URL: https://datasheet.ciiva.com/1960/tps2115a-1960794.pdf; ComponentLink5Description: https://datasheet.ciiva.com/1960/tps2115a-1960794.pdf; Supplier Part Number 1: 296-23394-1-ND

## Sheet BUCK_CONVERTERS.SchDoc
size A4
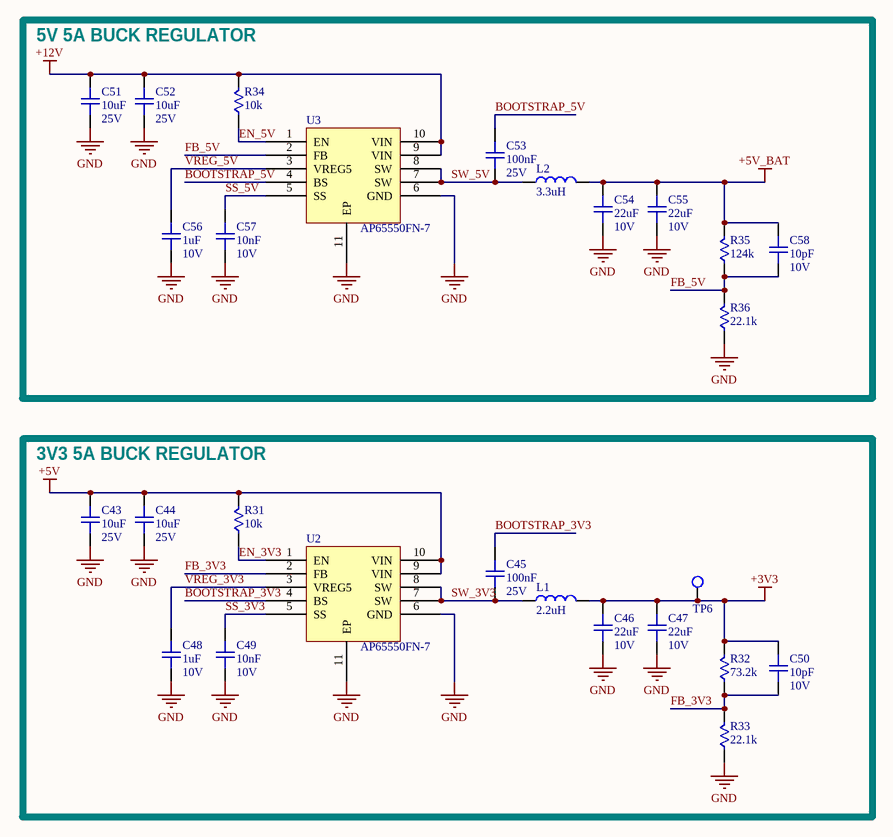
[diagram p2: BUCK_CONVERTERS.SchDoc]

### Parts
C43  10uF  Voltage Rating (DC): 25V  [R0805-3D]
C44  10uF  Voltage Rating (DC): 25V  [R0805-3D]
C45  100nF  Voltage Rating (DC): 25V  [C0402]
C46  22uF  Voltage Rating (DC): 10V  [R0805-3D]
C47  22uF  Voltage Rating (DC): 10V  [R0805-3D]
C48  1uF  Voltage Rating: 10V  [C0402]
C49  10nF  Voltage Rating: 10V  [C0402]
C50  10pF  Voltage Rating: 10V  [C0402]
C51  10uF  Voltage Rating (DC): 25V  [R0805-3D]
C52  10uF  Voltage Rating (DC): 25V  [R0805-3D]
C53  100nF  Voltage Rating (DC): 25V  [C0402]
C54  22uF  Voltage Rating (DC): 10V  [R0805-3D]
C55  22uF  Voltage Rating (DC): 10V  [R0805-3D]
C56  1uF  Voltage Rating: 10V  [C0402]
C57  10nF  Voltage Rating: 10V  [C0402]
C58  10pF  Voltage Rating: 10V  [C0402]
L1  2.2uH  [IND-6mm]
L2  3.3uH  [IND-6mm]
R31  10k  [R0402]
R32  73.2k  [R0402]
R33  22.1k  [R0402]
R34  10k  [R0402]
R35  124k  [R0402]
R36  22.1k  [R0402]
TP6  5015  [TP_HOOK]  (value not drawn)
U2  AP65550FN-7  [DFN-10]
U3  AP65550FN-7  [DFN-10]

### Blocks framed on the sheet
5V 5A BUCK REGULATOR: C51-C58 L2 R34-R36 U3
3V3 5A BUCK REGULATOR: C43-C50 L1 R31-R33 TP6 U2

### Nets
+3V3: C46.2 C47.2 C50.2 L1.2 R32.2 TP6.1
+5V: C43.2 C44.2 R31.2 U2.9(VIN) U2.10(VIN)
+5V_BAT: C54.2 C55.2 C58.2 L2.2 R35.2
+12V: C51.2 C52.2 R34.2 U3.9(VIN) U3.10(VIN)
GND: C43.1 C44.1 C46.1 C47.1 C48.1 C49.1 C51.1 C52.1 C54.1 C55.1 C56.1 C57.1 R33.1 R36.1 U2.6(GND) U2.11(EP) U3.6(GND) U3.11(EP)
BOOTSTRAP_3V3: C45.2 U2.4(BS)
BOOTSTRAP_5V: C53.2 U3.4(BS)
EN_3V3: R31.1 U2.1(EN)
EN_5V: R34.1 U3.1(EN)
FB_3V3: C50.1 R32.1 R33.2 U2.2(FB)
FB_5V: C58.1 R35.1 R36.2 U3.2(FB)
SS_3V3: C49.2 U2.5(SS)
SS_5V: C57.2 U3.5(SS)
SW_3V3: C45.1 L1.1 U2.7(SW) U2.8(SW)
SW_5V: C53.1 L2.1 U3.7(SW) U3.8(SW)
VREG_3V3: C48.2 U2.3(VREG5)
VREG_5V: C56.2 U3.3(VREG5)

### Library data of the parts
C43 C44 C51 C52 = TMK212BBJ106KG-T: CAP MLCC 10uF 25V X5R 0805; Manufacturer: Taiyo Yuden; Tolerance: 10%; Dielectric: X7R; Voltage: 16V; Supplier 1: Digi-Key; Manufacturer Part Number: TMK212BBJ106KG-T; Stock 1: 3000; Pricing 1: 1=0.21, 10=0.144, 100=0.0729, 500=0.0499, 1000=0.0441 (USD); Mount: Surface Mount; Case/Package: 0805; Number of Pins: 2; Case Code (Metric): 2012; Case Code (Imperial): 0805; Min Operating Temperature: -55°C; Max Operating Temperature: 85°C; Capacitance: 10uF; Packaging: Tape and Reel; Package Quantity: 1; Voltage Rating: 25V; Termination: SMD/SMT; Composition: Ceramic; Length: 0.079inch; Height: 1.25mm; Width: 0.049inch; Thickness: 0.053inch; Lead Free: Lead Free; REACH SVHC: No SVHC; ComponentLink1URL: https://www.yuden.co.jp/productdata/catalog/mlcc_all_e.pdf; ComponentLink1Description: https://www.yuden.co.jp/productdata/catalog/mlcc_all_e.pdf; ComponentLink2URL: http://www.farnell.com/datasheets/1481447.pdf; ComponentLink2Description: http://www.farnell.com/datasheets/1481447.pdf; Supplier Part Number 1: 587-2985-1-ND
C45 C53 = CC0402ZRY5V8BB104: CAP MLCC 0.1uF 25V Y5V 0402; Manufacturer: Yageo; Tolerance: 80%; Dissipation Factor: 12.5%; Insulation Resistance: 10GR; Supplier 1: Digi-Key; Manufacturer Part Number: CC0402ZRY5V8BB104; Stock 1: 100000; Pricing 1: 1=0.1, 10=0.031, 100=0.0136, 500=0.0097, 1000=0.0077, 2500=0.007, 5000=0.0064 (USD); Mount: Surface Mount; Case/Package: 0402; Number of Pins: 2; Weight: 2.3E-05oz; Case Code (Metric): 1005; Case Code (Imperial): 0402; Min Operating Temperature: -30°C; Max Operating Temperature: 85°C; Packaging: Tape and Reel; Capacitance: 100nF; Voltage Rating: 25V; Package Quantity: 1; Dielectric: Y5V; Termination: SMD/SMT; Composition: Ceramic; Length: 1mm; Height: 0.5mm; Width: 0.02inch; Thickness: 0.022inch; Depth: 0.5mm; Radiation Hardening: No; REACH SVHC: Unknown; Lead Free: Lead Free; Halogen Free: Halogen Free; ComponentLink1URL: http://www.yageo.com/documents/recent/UPY-GPHC_Y5V_6.3V-to-50V_8.pdf; ComponentLink1Description: http://www.yageo.com/documents/recent/UPY-GPHC_Y5V_6.3V-to-50V_8.pdf; ComponentLink2URL: http://www.farnell.com/datasheets/1132289.pdf; ComponentLink2Description: http://www.farnell.com/datasheets/1132289.pdf; ComponentLink3URL: http://www.yageo.com/documents/recent/UPY-GPHC_Y5V_6.3V-to-50V_5.pdf; ComponentLink3Description: http://www.yageo.com/documents/recent/UPY-GPHC_Y5V_6.3V-to-50V_5.pdf; Supplier Part Number 1: 311-1375-1-ND
C46 C47 C54 C55 = GRM21BR61A226ME51L: CAP MLCC 22uF 10V 0805 X5R 20% SMD 0805 85C Embossed T/R; Manufacturer: Murata; Supplier 1: Digi-Key; Manufacturer Part Number: GRM21BR61A226ME51L; Stock 1: 30000; Pricing 1: 1=0.35, 10=0.239, 100=0.1353, 500=0.0955, 1000=0.0836 (USD); Mount: Surface Mount; Case/Package: 0805; Weight: 0.000335oz; Case Code (Metric): 2012; Case Code (Imperial): 0805; Min Operating Temperature: -55°C; Max Operating Temperature: 85°C; Capacitance: 22uF; Tolerance: 20%; Packaging: Tape and Reel; Dielectric: X5R; Voltage Rating: 10V; Termination: SMD/SMT; Package Quantity: 3000; Length: 2mm; Height: 1.25mm; Width: 0.049inch; Thickness: 0.055inch; Depth: 1.25mm; Radiation Hardening: No; REACH SVHC: No SVHC; Lead Free: Lead Free; Supplier Part Number 1: 490-10511-1-ND
C48 C56 = CL05A105MP5NNNC: as C3 on sheet Power_Sensing; Supplier 1: Digi-Key; Manufacturer Part Number: CL05A105MP5NNNC; Stock 1: 100000; Pricing 1: 1=0.1, 10=0.031, 100=0.014, 500=0.01, 1000=0.0079, 2500=0.0072, 5000=0.0066 (USD); Mount: Surface Mount; Case/Package: 0402; Case Code (Metric): 1005; Case Code (Imperial): 0402; Min Operating Temperature: -55°C; Max Operating Temperature: 85°C; Package Quantity: 1; Packaging: Tape and Reel; Capacitance: 1uF; Tolerance: 20%; Dielectric: X5R; Voltage Rating (DC): 10V; Length: 1mm; Height: 0.5mm; Width: 0.02inch; Thickness: 0.022inch; Depth: 0.5mm; Radiation Hardening: No; Lead Free: Lead Free; ComponentLink1URL: https://media.digikey.com/pdf/Data%20Sheets/Samsung%20PDFs/CL_Series_MLCC_ds.pdf; ComponentLink1Description: https://media.digikey.com/pdf/Data%20Sheets/Samsung%20PDFs/CL_Series_MLCC_ds.pdf; Supplier Part Number 1: 1276-1448-1-ND
C49 C57 = GRM155R61A103KA01D: CAP MLCC 10nF 10V 0402 5R 10% SMD 0402 85C T/R; Manufacturer: Murata; Dielectric: X5R; Supplier 1: Digi-Key; Manufacturer Part Number: GRM155R61A103KA01D; Stock 1: 100000; Pricing 1: 1=0.1, 10=0.029, 100=0.013, 500=0.0093, 1000=0.0073, 2500=0.0066, 5000=0.0061 (USD); Mount: Surface Mount; Case/Package: 0402; Case Code (Metric): 1005; Case Code (Imperial): 0402; Min Operating Temperature: -55°C; Max Operating Temperature: 85°C; Tolerance: 10%; Packaging: Tape and Reel; Capacitance: 10nF; Package Quantity: 10000; Voltage Rating (DC): 10V; Termination: SMD/SMT; Length: 1mm; Height: 0.5mm; Width: 0.02inch; Thickness: 0.022inch; Depth: 0.5mm; Radiation Hardening: No; Lead Free: Lead Free; ComponentLink1URL: https://www.murata.com/~/media/webrenewal/support/library/catalog/products/capacitor/mlcc/c02e.ashx?la=en-us; ComponentLink1Description: https://www.murata.com/~/media/webrenewal/support/library/catalog/products/capacitor/mlcc/c02e.ashx?la=en-us; ComponentLink2URL: https://www.verical.com/server-webapp/html/getDatasheet?partID=330538; ComponentLink2Description: https://www.verical.com/server-webapp/html/getDatasheet?partID=330538; ComponentLink3URL: http://psearch.murata.com/capacitor/product/GRM155R61A103KA01%23.pdf; ComponentLink3Description: http://psearch.murata.com/capacitor/product/GRM155R61A103KA01%23.pdf; Supplier Part Number 1: 490-6296-1-ND
C50 C58 = 885012005007: CAP MLCC 10pF 10V 0402 C0G, NP0 0402 (1005 Metric) 0.039" L x 0.020" W (1.00mm x 0.50mm); Manufacturer: Wurth Electronics; Tolerance: 5%; Supplier 1: Digi-Key; Manufacturer Part Number: 885012005007; Stock 1: 20214; Pricing 1: 1=0.1, 10=0.018, 100=0.0159, 500=0.0141 (USD); Mount: Surface Mount; Case/Package: 0402; Case Code (Metric): 1005; Case Code (Imperial): 0402; Min Operating Temperature: -55°C; Max Operating Temperature: 125°C; Packaging: Tape and Reel; Capacitance: 10pF; Length: 0.039inch; Width: 0.02inch; Thickness: 0.022inch; Supplier Part Number 1: 732-7425-1-ND
L1 = 1255AY-2R2N=P3: IND 2.2uH 6.3A 19.2mOhm 30% 100KHz Ferrite  T/R; Manufacturer: Murata; Shielding: Shielded; DC Resistance (DCR): 19.2mR; Max DC Current: 4.7A; Supplier 1: Digi-Key; Manufacturer Part Number: 1255AY-2R2N=P3; Stock 1: 814; Pricing 1: 1=0.48, 10=0.423, 100=0.3019, 500=0.2536 (USD); Mount: Surface Mount; Case/Package: Nonstandard; Core Material: Ferrite; Packaging: Tape and Reel; Composition: Wirewound; Inductance: 2.2uh; Current Rating: 6.3A; Test Frequency: 100kHz; Tolerance: 30%; Length: 0.248inch; Width: 0.248inch; Height - Seated (Max): 0.177inch; Supplier Part Number 1: 490-10807-1-ND
L2 = 1264EY-3R3N=P3: IND 3.3µH 6.5A 25.2 mOhm Max Nonstandard; Manufacturer: Murata; Core Material: Ferrite; Shielding: Shielded; DC Resistance (DCR): 25.2mR; Test Frequency: 100kHz; Tolerance: 30%; Supplier 1: Digi-Key; Manufacturer Part Number: 1264EY-3R3N=P3; Stock 1: 81; Pricing 1: 1=0.51, 10=0.443, 100=0.3163, 500=0.2657 (USD); Mount: Surface Mount; Case/Package: Nonstandard; Packaging: Tape and Reel; Composition: Wirewound; Inductance: 3.3uh; Current Rating: 6.5A; Length: 0.248inch; Width: 0.248inch; Height - Seated (Max): 0.198inch; Supplier Part Number 1: 490-10821-1-ND
R31 R34 = RC0402JR-0710KL: as R9 on sheet Connectors; Supplier 1: Digi-Key; Manufacturer Part Number: RC0402JR-0710KL; Stock 1: 47303622; Pricing 1: 1=0.1, 10=0.018, 100=0.0073, 1000=0.0033, 2500=0.0029, 5000=0.0024 (USD); Case/Package: 0402; Case Code (Metric): 1005; Case Code (Imperial): 0402; Min Operating Temperature: -55°C; Max Operating Temperature: 155°C; Packaging: Tape and Reel; Tolerance: 5%; Package Quantity: 1; Composition: Thick Film; Number of Terminations: 2; Termination: SMD/SMT; Military Standard: Not; Features: Moisture Resistant; Length: 1mm; Height: 0.016inch; Width: 0.02inch; Depth: 0.5mm; REACH SVHC: Unknown; Lead Free: Lead Free; Supplier Part Number 1: 311-10KJRCT-ND
R32 = RMCF0402FT73K2: RES SMD 73.2K Ohm 0402 1% 0.063W(1/16W) ±100ppm/C Molded SMD Automotive T/R; Manufacturer: Stackpole Electronics; Resistance: 73.2kR; Max Power Dissipation: 63mW; Temperature Coefficient: 100ppm/°C; Supplier 1: Digi-Key; Manufacturer Part Number: RMCF0402FT73K2; Stock 1: 58296; Pricing 1: 1=0.1, 10=0.016, 100=0.0064, 1000=0.0029, 2500=0.0025, 5000=0.0021 (USD); Mount: Surface Mount; Case/Package: 0402; Case Code (Metric): 1005; Case Code (Imperial): 0402; Contact Plating: Matte,Tin; Min Operating Temperature: -55°C; Max Operating Temperature: 155°C; Tolerance: 1%; Features: Automotive AEC-Q200; Packaging: Tape and Reel; Composition: Thick Film; Number of Terminations: 2; Military Standard: Not; Length: 0.039inch; Height: 0.016inch; Width: 0.02inch; Depth: 0.5mm; Lead Free: Lead Free; Supplier Part Number 1: RMCF0402FT73K2CT-ND
R33 R36 = RMCF0402FT22K1: RES SMD 22.1K 0402 Ohm 1% 1/16W ±100ppm/C Molded SMD SMD Paper T/R; Manufacturer: Stackpole Electronics; Resistance: 22.1kR; Max Power Dissipation: 63mW; Temperature Coefficient: 100ppm/°C; Supplier 1: Digi-Key; Manufacturer Part Number: RMCF0402FT22K1; Stock 1: 115582; Pricing 1: 1=0.1, 10=0.016, 100=0.0064, 1000=0.0029, 2500=0.0025, 5000=0.0021 (USD); Mount: Surface Mount; Case/Package: 0402; Case Code (Metric): 1005; Case Code (Imperial): 0402; Contact Plating: Matte,Tin; Min Operating Temperature: -55°C; Max Operating Temperature: 155°C; Tolerance: 1%; Packaging: Tape and Reel; Composition: Thick Film; Number of Terminations: 2; Features: Automotive AEC-Q200; Length: 0.039inch; Height: 0.016inch; Width: 0.02inch; Radiation Hardening: No; Lead Free: Lead Free; Supplier Part Number 1: RMCF0402FT22K1CT-ND
R35 = RMCF0402FT124K: RES SMD 124K 0402 1% 1/16W 100ppm/C Molded SMD Paper T/R; Manufacturer: Stackpole Electronics; Resistance: 124kR; Max Power Dissipation: 63mW; Temperature Coefficient: 100ppm/°C; Supplier 1: Digi-Key; Manufacturer Part Number: RMCF0402FT124K; Stock 1: 25555; Pricing 1: 1=0.1, 10=0.016, 100=0.0064, 1000=0.0029, 2500=0.0025, 5000=0.0021 (USD); Mount: Surface Mount; Case/Package: 0402; Case Code (Metric): 1005; Case Code (Imperial): 0402; Contact Plating: Matte,Tin; Min Operating Temperature: -55°C; Max Operating Temperature: 155°C; Packaging: Tape and Reel; Tolerance: 1%; Package Quantity: 10000; Composition: Thick Film; Number of Terminations: 2; Features: Automotive AEC-Q200; Length: 0.039inch; Height: 0.016inch; Width: 0.02inch; Lead Free: Lead Free; Supplier Part Number 1: RMCF0402FT124KCT-ND
TP6 = 5015: as TP1 on sheet Power_Sensing; Supplier 1: Digi-Key; Manufacturer Part Number: 5015; Stock 1: 1937775; Pricing 1: 1=0.44, 10=0.421, 25=0.3604, 50=0.3064, 100=0.2944, 250=0.2644, 500=0.2524 (USD); Mount: Surface Mount; Colour: White; Contact Material: Bronze; Contact Plating: Tin,Silver,Lead; Material: Bronze,Silver; Package Quantity: 1; Packaging: Tape and Reel; Termination: Solder; Orientation: Straight; Length: 2.66mm; Height: 0.06inch; Thickness: 0.01inch; Depth: 1.01mm; REACH SVHC: No SVHC; Lead Free: Lead Free; ComponentLink1URL: https://datasheet.ciiva.com/2917/5015-2917616.pdf; ComponentLink1Description: https://datasheet.ciiva.com/2917/5015-2917616.pdf; ComponentLink2URL: https://datasheet.ciiva.com/2917/5015-2917617.pdf; ComponentLink2Description: https://datasheet.ciiva.com/2917/5015-2917617.pdf; ComponentLink3URL: https://datasheet.ciiva.com/1123/5015-1123862.pdf; ComponentLink3Description: https://datasheet.ciiva.com/1123/5015-1123862.pdf; ComponentLink4URL: https://datasheet.ciiva.com/16883/70182998-16883734.pdf; ComponentLink4Description: https://datasheet.ciiva.com/16883/70182998-16883734.pdf; Supplier Part Number 1: 36-5015CT-ND
U2 U3 = AP65550FN-7: IC BUCK SYNC 5A, 18V VIN MAX 650kHz COT Step-Down Conv; Manufacturer: Diodes; Number of Outputs: 1; Min Input Voltage: 4.5V; Min Output Voltage: 760mV; Max Output Voltage: 6V; Synchronous Rectifier: Yes; Operating Supply Current: 900uA; Output Type: Adjustable; Output Configuration: Positive; Supplier 1: Digi-Key; Manufacturer Part Number: AP65550FN-7; Stock 1: 135; Pricing 1: 1=0.77, 10=0.68, 100=0.5212, 500=0.412, 1000=0.3296 (USD); Mount: Surface Mount; Min Operating Temperature: -40°C; Max Operating Temperature: 85°C; Packaging: Tape and Reel; Max Input Voltage: 18V; Output Current: 5A; Switching Frequency: 650kHz; Output Voltage: 6V; Package Quantity: 3000; Min Supply Voltage: 4.5V; Lead Free: Lead Free; Supplier Part Number 1: AP65550FN-7DICT-ND